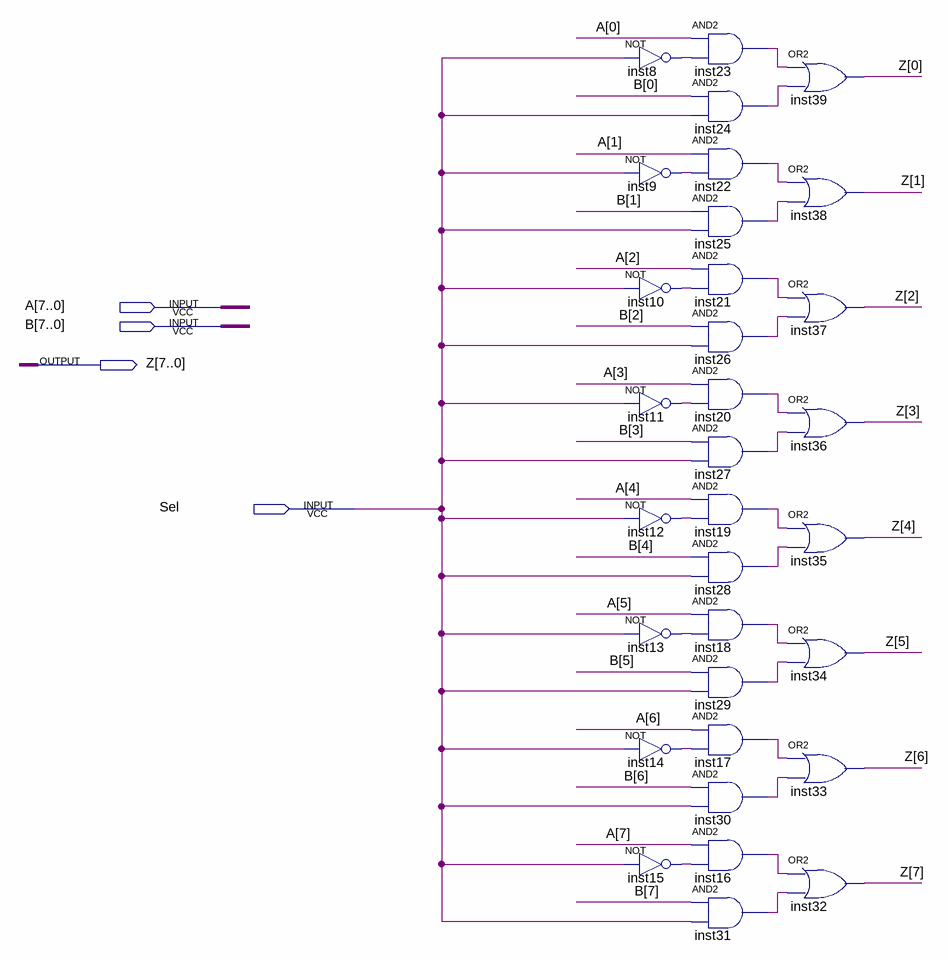
[diagram p0: schematic sheet]
// Quartus schematic Multiplexador.bdf as structural Verilog: 32 symbols, 4 pins
module Multiplexador (
  input  [7:0] A,
  input  [7:0] B,
  input  Sel,
  output [7:0] Z
);

  wire inst8_out, inst9_out, inst10_out, inst11_out, inst12_out, inst13_out, inst14_out, inst15_out,
       inst16_out, inst17_out, inst18_out, inst19_out, inst20_out, inst21_out, inst22_out, inst23_out,
       inst24_out, inst25_out, inst26_out, inst27_out, inst28_out, inst29_out, inst30_out, inst31_out;

  not inst8 (inst8_out, Sel);
  not inst9 (inst9_out, Sel);
  not inst10 (inst10_out, Sel);
  not inst11 (inst11_out, Sel);
  not inst12 (inst12_out, Sel);
  not inst13 (inst13_out, Sel);
  not inst14 (inst14_out, Sel);
  not inst15 (inst15_out, Sel);
  and inst23 (inst23_out, A[0], inst8_out);
  and inst24 (inst24_out, B[0], Sel);
  and inst22 (inst22_out, A[1], inst9_out);
  and inst25 (inst25_out, B[1], Sel);
  and inst21 (inst21_out, A[2], inst10_out);
  and inst26 (inst26_out, B[2], Sel);
  and inst20 (inst20_out, A[3], inst11_out);
  and inst27 (inst27_out, B[3], Sel);
  and inst19 (inst19_out, A[4], inst12_out);
  and inst28 (inst28_out, B[4], Sel);
  and inst18 (inst18_out, A[5], inst13_out);
  and inst29 (inst29_out, B[5], Sel);
  and inst17 (inst17_out, A[6], inst14_out);
  and inst30 (inst30_out, B[6], Sel);
  and inst16 (inst16_out, A[7], inst15_out);
  and inst31 (inst31_out, B[7], Sel);
  or inst39 (Z[0], inst23_out, inst24_out);
  or inst38 (Z[1], inst22_out, inst25_out);
  or inst37 (Z[2], inst21_out, inst26_out);
  or inst36 (Z[3], inst20_out, inst27_out);
  or inst35 (Z[4], inst19_out, inst28_out);
  or inst34 (Z[5], inst18_out, inst29_out);
  or inst33 (Z[6], inst17_out, inst30_out);
  or inst32 (Z[7], inst16_out, inst31_out);
endmodule
